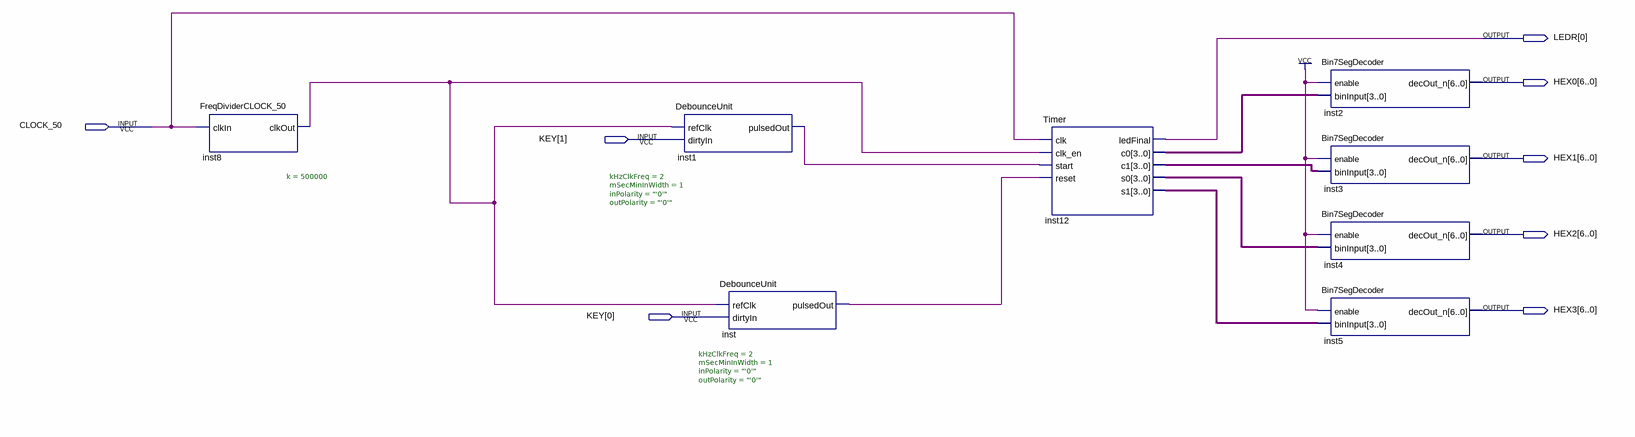
[diagram p0: schematic sheet]
// Quartus schematic TimerProject.bdf as structural Verilog: 8 symbols, 8 pins
module TimerProject (
  input  CLOCK_50,
  input  [1:0] KEY,
  output [0:0] LEDR,
  output [6:0] HEX0,
  output [6:0] HEX1,
  output [6:0] HEX2,
  output [6:0] HEX3
);

  wire inst1_pulsedout, inst8_clkout, inst_pulsedout;
  wire [3:0] inst12_c0, inst12_c1, inst12_s0, inst12_s1;

  FreqDividerCLOCK_50 #(.k(500000)) inst8 (.clkIn(CLOCK_50), .clkOut(inst8_clkout));
  DebounceUnit #(.kHzClkFreq(2), .mSecMinInWidth(1), .inPolarity("'0'"), .outPolarity("'0'")) inst1 (
    .refClk(inst8_clkout), .dirtyIn(KEY[1]), .pulsedOut(inst1_pulsedout));
  DebounceUnit #(.kHzClkFreq(2), .mSecMinInWidth(1), .inPolarity("'0'"), .outPolarity("'0'")) inst (
    .refClk(inst8_clkout), .dirtyIn(KEY[0]), .pulsedOut(inst_pulsedout));
  Timer inst12 (
    .clk(CLOCK_50), .clk_en(inst8_clkout), .start(inst1_pulsedout), .reset(inst_pulsedout),
    .ledFinal(LEDR[0]), .c0(inst12_c0), .c1(inst12_c1), .s0(inst12_s0), .s1(inst12_s1));
  Bin7SegDecoder inst2 (.enable(1'b1), .binInput(inst12_c0), .decOut_n(HEX0));
  Bin7SegDecoder inst3 (.enable(1'b1), .binInput(inst12_c1), .decOut_n(HEX1));
  Bin7SegDecoder inst4 (.enable(1'b1), .binInput(inst12_s0), .decOut_n(HEX2));
  Bin7SegDecoder inst5 (.enable(1'b1), .binInput(inst12_s1), .decOut_n(HEX3));
endmodule
